# EAGLE design stm32f410rb_pcm5100 (EAGLE 7.2.0)
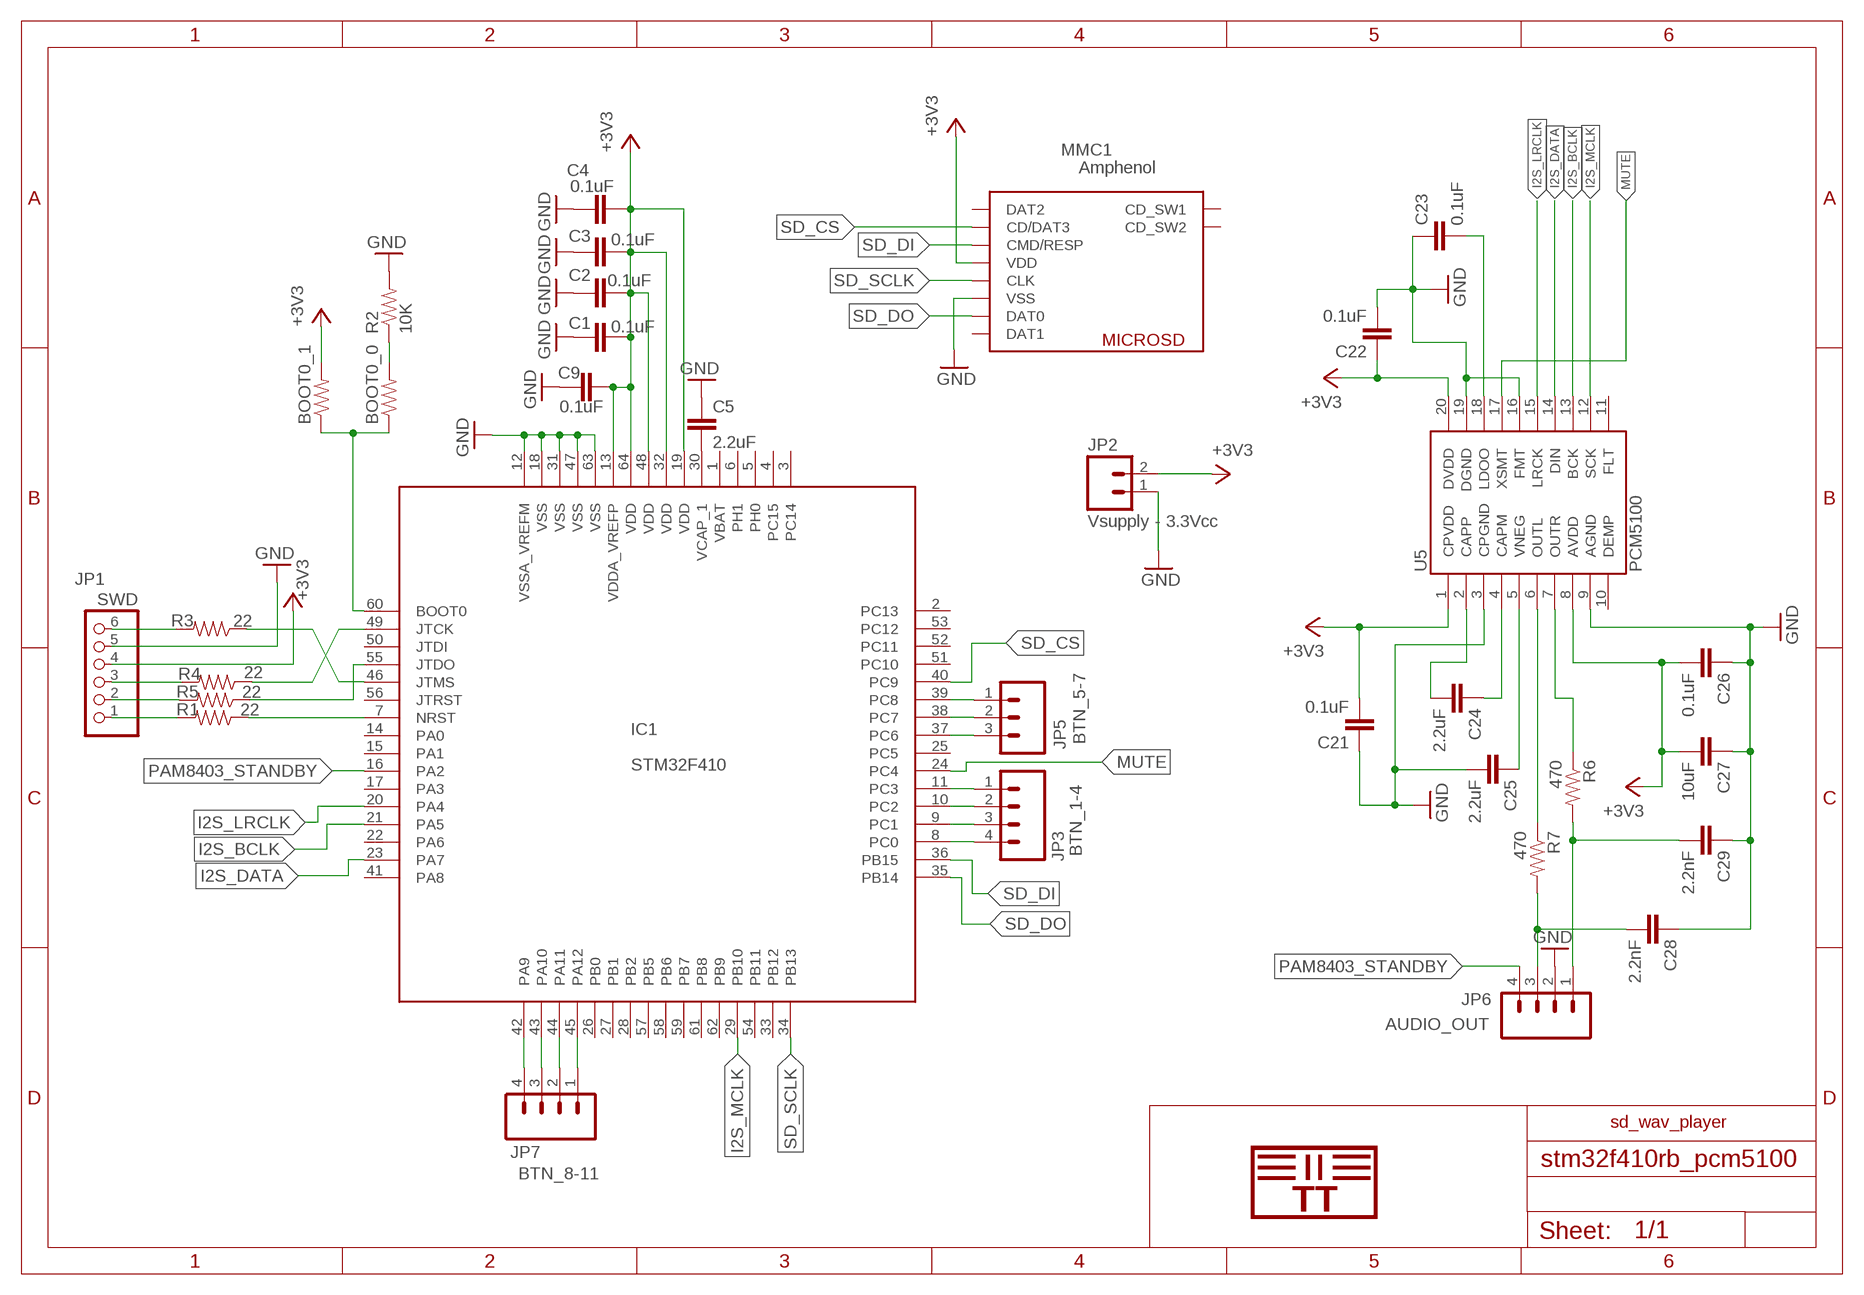
[diagram p0: schematic, sheet 1]

## Parts
BOOT0_0  RESISTOR0603-RES  [0603-RES]
BOOT0_1  RESISTOR0603-RES  [0603-RES]
C1  0.1uF  CAP0805  [0805]
C2  0.1uF  CAP0805  [0805]
C3  0.1uF  CAP0805  [0805]
C4  0.1uF  CAP0805  [0805]
C5  2.2uF  CAP0805  [0805]
C9  0.1uF  CAP0805  [0805]
C21  0.1uF  CAP0805  [0805]
C22  0.1uF  CAP0805  [0805]
C23  0.1uF  CAP0805  [0805]
C24  2.2uF  CAP0805  [0805]
C25  2.2uF  CAP0805  [0805]
C26  0.1uF  CAP0805  [0805]
C27  10uF  CAP0805  [0805]
C28  2.2nF  CAP0805  [0805]
C29  2.2nF  CAP0805  [0805]
IC1  STM32F410  STM32F410_8_B_LQFP64  [LQFP64]
JP1  SWD  PINHD-1X6  [1X06]
JP2  Vsupply - 3.3Vcc  M023.5MM  [SCREWTERMINAL-3.5MM-2]
JP3  BTN_1-4  M04SCREW  [SCREWTERMINAL-3.5MM-4]
JP5  BTN_5-7  M03SCREW  [SCREWTERMINAL-3.5MM-3]
JP6  AUDIO_OUT  M04SCREW  [SCREWTERMINAL-3.5MM-4]
JP7  BTN_8-11  M04SCREW  [SCREWTERMINAL-3.5MM-4]
MMC1  Amphenol  MICROSD_AMPHENOL  [MICROSD_AMPHENOL]
R1  22  RESISTOR0805-RES  [0805]
R2  10K  RESISTOR0805-RES  [0805]
R3  22  RESISTOR0805-RES  [0805]
R4  22  RESISTOR0805-RES  [0805]
R5  22  RESISTOR0805-RES  [0805]
R6  470  RESISTOR0805-RES  [0805]
R7  470  RESISTOR0805-RES  [0805]
U5  PCM5100  ROBERTSONICS_PCM5100  [ROBERTSONICS_PW_R-PDSO-G20]

## Nets
GND: C1.2 C2.2 C3.2 C4.2 C5.1 C9.2 C21.1 C22.2 C23.1 C25.2 C26.1 C27.1 C28.1 C29.1 IC1.12(VSSA_VREFM) IC1.18(VSS) IC1.31(VSS) IC1.47(VSS) IC1.63(VSS) JP1.5 JP2.1 JP6.2 MMC1.VSS R2.2 U5.3(CPGND) U5.9(AGND) U5.16(FMT) U5.19(DGND)
I2S_BCLK: IC1.21(PA5) U5.13(BCK)
I2S_DATA: IC1.23(PA7) U5.14(DIN)
I2S_LRCLK: IC1.20(PA4) U5.15(LRCK)
I2S_MCLK: IC1.29(PB10) U5.12(SCK)
LOUTL: C28.2 JP6.3 R7.2
LOUTR: C29.2 JP6.1 R6.2
MUTE: IC1.24(PC4) U5.17(XSMT)
N$1: IC1.11(PC3) JP3.1
N$2: IC1.10(PC2) JP3.2
N$3: IC1.9(PC1) JP3.3
N$4: IC1.8(PC0) JP3.4
N$5: C5.2 IC1.30(VCAP_1)
N$6: IC1.7(NRST) R1.1
N$7: IC1.49(JTCK) R4.1
N$8: IC1.55(JTDO) R5.1
N$9: IC1.46(JTMS) R3.1
N$10: BOOT0_0.2 R2.1
N$12: IC1.39(PC8) JP5.1
N$13: IC1.38(PC7) JP5.2
N$14: C23.2 U5.18(LDOO)
N$15: R6.1 U5.7(OUTR)
N$16: C24.2 U5.2(CAPP)
N$17: C24.1 U5.4(CAPM)
N$18: C25.1 U5.5(VNEG)
N$19: R7.1 U5.6(OUTL)
N$20: BOOT0_0.1 BOOT0_1.1 IC1.60(BOOT0)
N$21: IC1.37(PC6) JP5.3
N$22: IC1.45(PA12) JP7.1
N$23: IC1.44(PA11) JP7.2
N$24: IC1.43(PA10) JP7.3
N$25: IC1.42(PA9) JP7.4
N$26: JP1.6 R3.2
N$27: JP1.3 R4.2
N$28: JP1.2 R5.2
N$29: JP1.1 R1.2
PAM8403_STANDBY: IC1.16(PA2) JP6.4
SD_CS: IC1.40(PC9) MMC1.CD/DAT3
SD_DI: IC1.36(PB15) MMC1.CMD/RESP
SD_DO: IC1.35(PB14) MMC1.DAT0
SD_SCLK: IC1.34(PB13) MMC1.CLK
VCC: BOOT0_1.2 C1.1 C2.1 C3.1 C4.1 C9.1 C21.2 C22.1 C26.2 C27.2 IC1.13(VDDA_VREFP) IC1.19(VDD) IC1.32(VDD) IC1.48(VDD) IC1.64(VDD) JP1.4 JP2.2 MMC1.VDD U5.1(CPVDD) U5.8(AVDD) U5.20(DVDD) ; supply symbol labelled +3V3
Unconnected: IC1.1(VBAT) IC1.2(PC13) IC1.3(PC14) IC1.4(PC15) IC1.5(PH0) IC1.6(PH1) IC1.14(PA0) IC1.15(PA1) IC1.17(PA3) IC1.22(PA6) IC1.25(PC5) IC1.26(PB0) IC1.27(PB1) IC1.28(PB2) IC1.33(PB12) IC1.41(PA8) IC1.50(JTDI) IC1.51(PC10) IC1.52(PC11) IC1.53(PC12) IC1.54(PB11) IC1.56(JTRST) IC1.57(PB5) IC1.58(PB6) IC1.59(PB7) IC1.61(PB8) IC1.62(PB9) MMC1.CD_SW1 MMC1.CD_SW2 MMC1.DAT1 MMC1.DAT2 U5.10(DEMP) U5.11(FLT)

## Notes on the sheet
- sd_wav_player
- TT

## Library data of the parts
BOOT0_0 BOOT0_1 R1-R7 = SparkFun-Passives:RESISTOR: Resistor Basic schematic elements and footprints for 0603, 1206, and PTH resistors.
C1-C5 C9 C21-C29 = SparkFun-Passives:CAP: Capacitor Standard 0603 ceramic capacitor, and 0.1" leaded capacitor.
IC1 = pel_stm32:STM32F410_8_B_LQFP64: STM32F410_8_B_LQFP64.bsd edit this description Auto generated by make-symbol-device-package-bsdl.ulp Rev. 18 Source: STM32F410_8_B_LQFP64.bsd
JP1 = pinhead:PINHD-1X6: PIN HEADER
JP2 = SparkFun-Connectors:M02: Standard 2-pin 0.1" header. Use with - straight break away headers ( PRT-00116) - right angle break away headers (PRT-00553) - swiss pins (PRT-00743) - machine pins (PRT-00117) - female headers (PRT-00115) Molex polarized connector foot print use with: PRT-08233 with associated crimp pins and housings. 2.54_SCREWTERM for use with PRT-10571. 3.5mm Screw Terminal footprints for PRT-08084 5mm Screw Terminal footprints for use with PRT-08432; PROD_ID: CONN-08399
JP3 JP6 JP7 = SparkFun-Connectors:M04: Header 4 Standard 4-pin 0.1" header. Use with straight break away headers (SKU : PRT-00116), right angle break away headers (PRT-00553), swiss pins (PRT-00743), machine pins (PRT-00117), and female headers (PRT-00115). Molex polarized connector foot print use with SKU : PRT-08231 with associated crimp pins and housings. 1MM SMD Version SKU: PRT-10208
JP5 = SparkFun-Connectors:M03: Header 3 Standard 3-pin 0.1" header. Use with straight break away headers (SKU : PRT-00116), right angle break away headers (PRT-00553), swiss pins (PRT-00743), machine pins (PRT-00117), and female headers (PRT-00115). Molex polarized connector foot print use with SKU : PRT-08232 with associated crimp pins and housings.
MMC1 = microsd_amphenol:MICROSD_AMPHENOL: AMPHENOL COMMERCIAL PRODUCTS The 114-00841-68 is a top mount microSD Memory Card Connector with gold-plated contact and tin-plated solder tail. http://ro.farnell.com/amphenol-commercial-products/114-00841-68/memory-card-connector-microsd/dp/2293708?CMP=i-ddd7-00001003
U5 = stm32f410rb_pcm5100:ROBERTSONICS_PCM5100: PCM5100 Stereo DAC

## Board
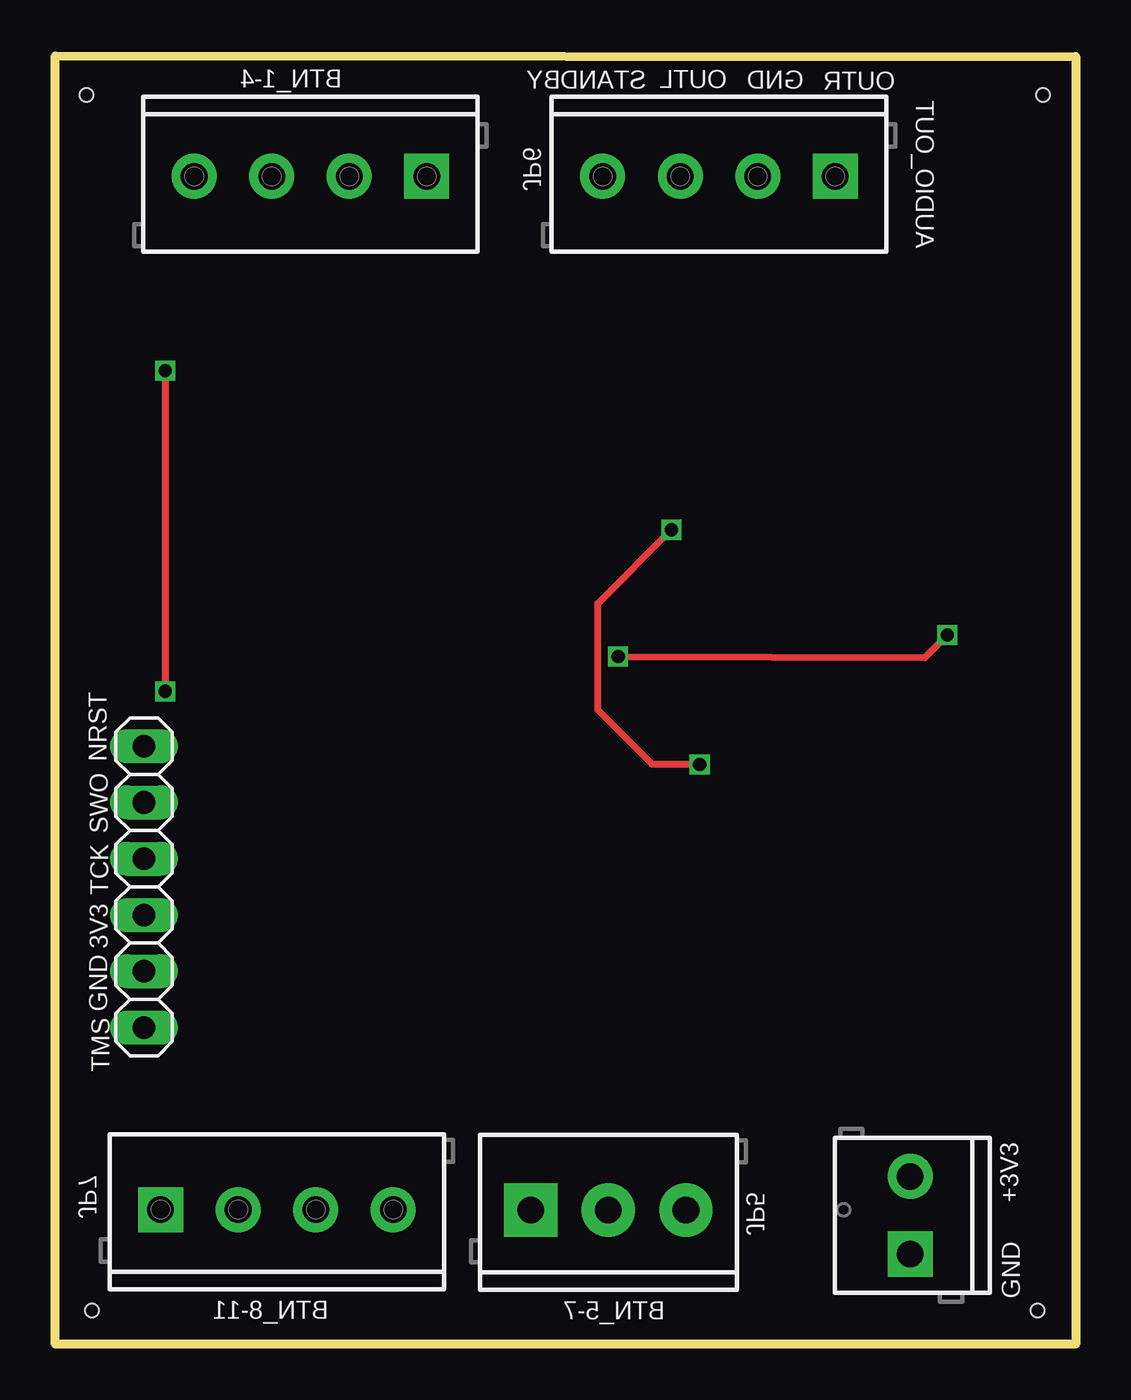
[diagram p1: board, top side]
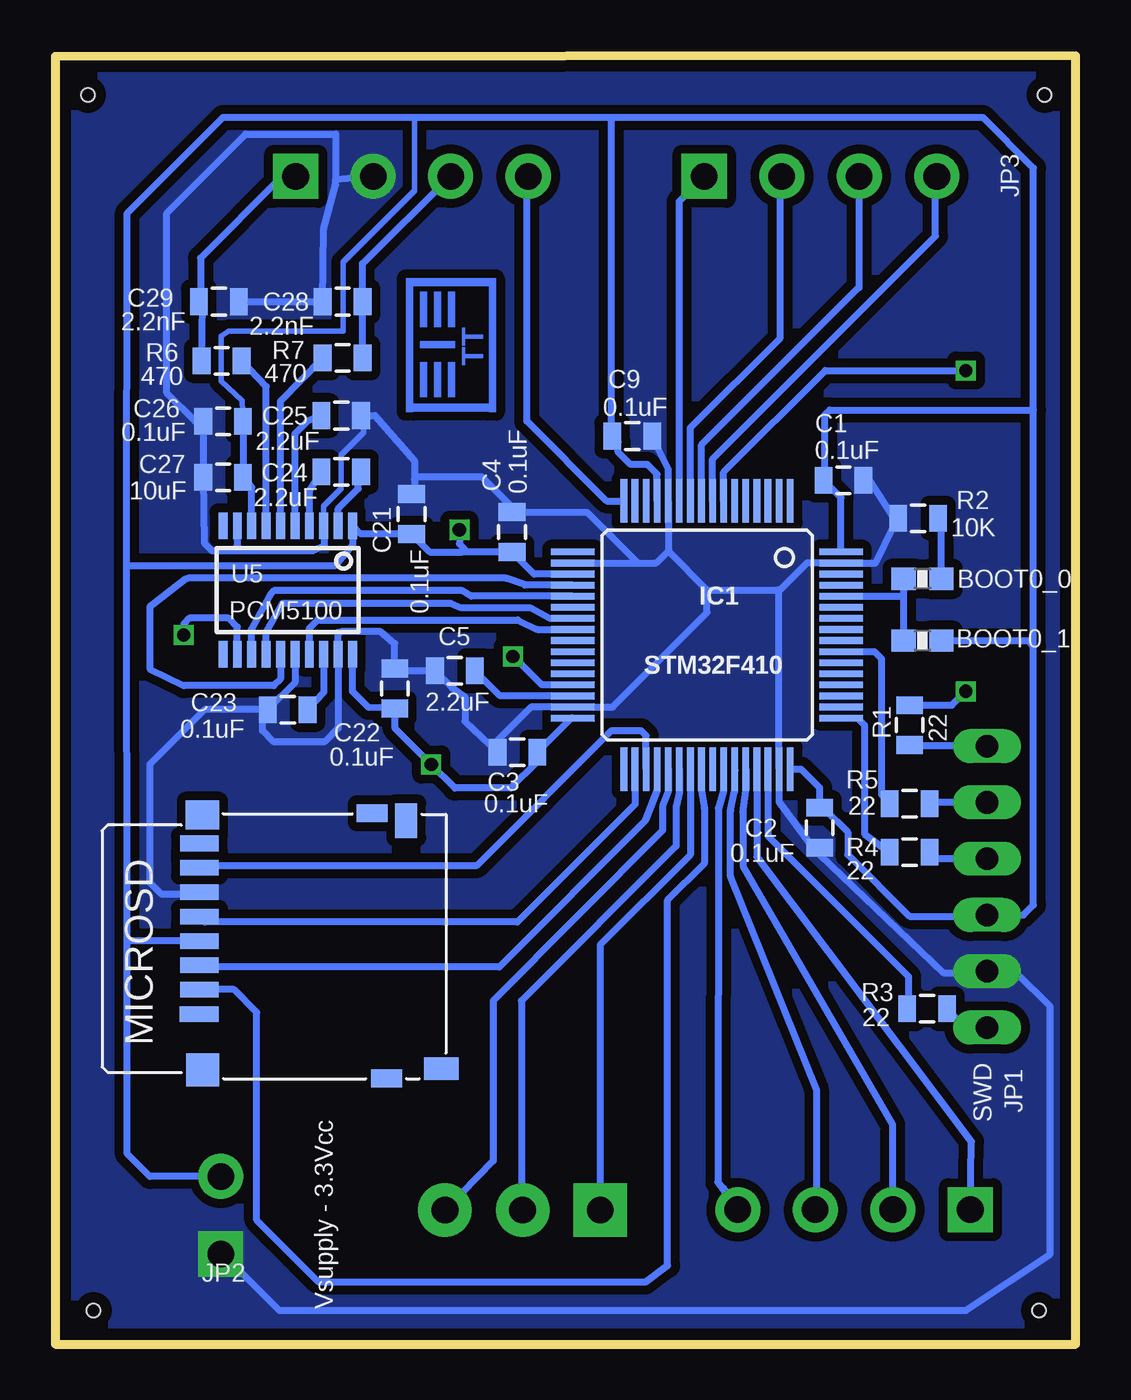
[diagram p2: board, bottom side, seen from below]

Size 46.05 x 58.17 mm. Coordinates in mm from the lower left corner, seen from the top.
Outline: 0,0 46.02,0 46.02,58.17 0,58.17 0,58.14
Outline: 0,58.14 46.05,58.12 46.05,0 0,0
Outline: 0,0 0,58.14
Copper layers (1*16): Top 0.035mm / dielectric 1.6mm / Bottom 0.035mm
Design rules "Elecrow_2-layer_PCB_eagle_rule *": minimum track width 6mil, minimum drill 12mil, track to track 6mil, track to pad 6mil, pad to pad 6mil, via to via 8mil, smd to smd 0mil, copper to edge 20mil, drill to drill 10mil, minimum pad ring 6mil, minimum via ring 6mil, stop-mask expansion 0mil, vias tented up to drill 100mil, thermal gap 10mil
Holes 0.6 mm at 1.4,56.39 44.58,56.39 1.65,1.52 44.32,1.52

### Footprints (pad centres in the part's own frame; a part is rotated, then mirrored left to right if it is on the bottom)
0603-RES = smd 1.1 x 1: 1 -0.85,0; 2 0.85,0
0805 = smd 0.8 x 1.2: 1 -0.9,0; 2 0.9,0
LQFP64 = smd 1.962 x 0.3: 1 -6.05,3.75; 2 -6.05,3.25; 3 -6.05,2.75; 4 -6.05,2.25; 5 -6.05,1.75; 6 -6.05,1.25; 7 -6.05,0.75; 8 -6.05,0.25; 9 -6.05,-0.25; 10 -6.05,-0.75; 11 -6.05,-1.25; 12 -6.05,-1.75; 13 -6.05,-2.25; 14 -6.05,-2.75; 15 -6.05,-3.25; 16 -6.05,-3.75; 33 6.05,-3.75; 34 6.05,-3.25; 35 6.05,-2.75; 36 6.05,-2.25; 37 6.05,-1.75; 38 6.05,-1.25; 39 6.05,-0.75; 40 6.05,-0.25; 41 6.05,0.25; 42 6.05,0.75; 43 6.05,1.25; 44 6.05,1.75; 45 6.05,2.25; 46 6.05,2.75; 47 6.05,3.25; 48 6.05,3.75 | smd 0.3 x 1.962: 17 -3.75,-6.05; 18 -3.25,-6.05; 19 -2.75,-6.05; 20 -2.25,-6.05; 21 -1.75,-6.05; 22 -1.25,-6.05; 23 -0.75,-6.05; 24 -0.25,-6.05; 25 0.25,-6.05; 26 0.75,-6.05; 27 1.25,-6.05; 28 1.75,-6.05; 29 2.25,-6.05; 30 2.75,-6.05; 31 3.25,-6.05; 32 3.75,-6.05; 49 3.75,6.05; 50 3.25,6.05; 51 2.75,6.05; 52 2.25,6.05; 53 1.75,6.05; 54 1.25,6.05; 55 0.75,6.05; 56 0.25,6.05; 57 -0.25,6.05; 58 -0.75,6.05; 59 -1.25,6.05; 60 -1.75,6.05; 61 -2.25,6.05; 62 -2.75,6.05; 63 -3.25,6.05; 64 -3.75,6.05
1X06 = drill 1.016 long: 1 -6.35,0; 2 -3.81,0; 3 -1.27,0; 4 1.27,0; 5 3.81,0; 6 6.35,0
SCREWTERMINAL-3.5MM-2 = drill 1.2 pad 2.032 square: 1 -1.778,0 | drill 1.2 pad 2.032: 2 1.722,0
SCREWTERMINAL-3.5MM-4 = drill 1.2 pad 2.032 square: 1 -5.334,0 | drill 1.2 pad 2.032: 2 -1.834,0; 3 1.666,0; 4 5.166,0
SCREWTERMINAL-3.5MM-3 = drill 1.2 pad 2.413 square: 1 -3.556,0 | drill 1.2 pad 2.413: 2 -0.056,0; 3 3.444,0
MICROSD_AMPHENOL = smd 0.7 x 1.75: CD/DAT3 2.1,-5.51; CLK -1.2,-5.51; CMD/RESP 1,-5.51; DAT0 -3.4,-5.51; DAT1 -4.5,-5.51; DAT2 3.21,-5.52; VDD -0.1,-5.51; VSS -2.3,-5.51 | smd 1 x 1.55: CD_SW1 5.66,5.41 | smd 1.55 x 1: CD_SW2 -5.53,3.82 | smd 1.3 x 1.5: NC1 -5.78,-5.38 | smd 1.5 x 1.5: NC2 5.72,-5.37 | smd 0.8 x 1.4: NC3 -5.86,2.29; NC_4 6.1,2.93
ROBERTSONICS_PW_R-PDSO-G20 = smd 0.4 x 1.2: 1 -2.925,-2.9; 2 -2.275,-2.9; 3 -1.625,-2.9; 4 -0.975,-2.9; 5 -0.325,-2.9; 6 0.325,-2.9; 7 0.975,-2.9; 8 1.625,-2.9; 9 2.275,-2.9; 10 2.925,-2.9; 11 2.925,2.9; 12 2.275,2.9; 13 1.625,2.9; 14 0.975,2.9; 15 0.325,2.9; 16 -0.325,2.9; 17 -0.975,2.9; 18 -1.625,2.9; 19 -2.275,2.9; 20 -2.925,2.9

### Placement (x,y rotation side)
BOOT0_0  6.91,34.54 0 bottom
BOOT0_1  6.91,31.75 0 bottom
C1  10.48,38.99 0 bottom
C2  11.56,23.3 270 bottom
C3  25.2,26.72 180 bottom
C4  25.44,36.65 90 bottom
C5  28.02,30.39 0 bottom
C9  20.02,40.98 0 bottom
C21  29.97,37.47 270 bottom
C22  30.73,29.59 90 bottom
C23  35.56,28.64 0 bottom
C24  33.15,39.37 0 bottom
C25  33.15,41.91 0 bottom
C26  38.48,41.66 0 bottom
C27  38.48,39.12 0 bottom
C28  33.08,47.05 0 bottom
C29  38.67,47.05 180 bottom
IC1  16.64,32 270 bottom
JP1  4,20.64 270 top
JP2  38.58,5.84 90 top
JP3  11.43,52.7 180 top
JP5  25.02,6.05 0 top
JP6  29.87,52.7 180 top
JP7  10.08,6.07 0 top
MMC1  34.04,18.1 270 bottom
R1  7.49,27.94 270 bottom
R2  7.11,37.27 180 bottom
R3  6.71,15.14 0 bottom
R4  7.49,22.2 0 bottom
R5  7.49,24.38 0 bottom
R6  38.54,44.39 180 bottom
R7  33.08,44.51 0 bottom
U5  35.56,34.04 180 bottom

### Tracks (layer width: path | path; a pad name or v marks a point on that pad's centre or on a via)
GND
  Bottom 0.254: U5.3 33.93,37.82 33.15,38.61 33.15,40.13 32.13,41.15 32.13,41.49 C25.2
  Bottom 0.305: 13.39,33.98 IC1.47 13.39,25.55 13.39,24.46 11.86,22.4 C2.2 11.56,22.1 5.97,16.76 4.06,16.76 JP1.5 3.94,16.76 2.67,16.76 1.14,15.24 1.14,4.06 4.95,1.52 35.94,1.52 38.48,4.06 JP2.1 | 18.39,35.79 IC1.12 18.39,39.49 C9.2 | 18.39,35.79 16.64,34.04 | 16.64,34.04 13.44,34.04 13.39,33.98 | IC1.18 19.76,35.25 | 19.76,35.25 18.92,35.25 18.39,35.79 | 8,37.31 R2.2 | 8.23,37.31 8.23,36.88 9.02,35.25 IC1.63 12.12,35.25 13.39,33.98 | 8.23,37.31 8.05,37.27 R2.2 | C29.1 C28.1 33.93,50.32 33.4,52.32 33.4,52.58 | C25.2 31.62,41.91 29.85,39.88 29.85,39.04 | 29.85,39.04 29.85,38.44 C21.1 | U5.9 37.84,35.93 37.72,35.81 | 37.72,35.81 34.42,35.81 33.91,36.07 33.91,36.91 U5.3 | 37.72,35.81 38.99,35.81 39.33,36.16 C27.1 C26.1 39.75,41.66 41.02,42.93 41.02,51.05 37.46,54.61 33.4,54.61 33.4,52.58 | 33.4,52.58 JP6.2 | C23.1 39.31,28.64 41.78,26.16 41.78,20.83 41.27,20.32 39.62,20.32 MMC1.VSS | C22.2 30.73,31.62 31.37,32.16 33.15,32.16 33.28,32.12 U5.19 33.28,27.8 33.91,27.18 36.2,27.18 36.7,27.69 36.7,28.35 C23.1 | 36.45,28.68 C23.1 | 30.71,30.42 C22.2 | 16.64,34.04 16.64,33.02 20.9,28.75 IC1.31 24.59,28.75 26.09,27.25 26.09,26.73 C3.2 27.56,28.11 27.56,29.21 28.16,29.63 C5.1 30.63,30.39 C22.2 | C1.2 9.63,38.94 9.27,38.94 8.23,37.31 | 8.23,37.31 R2.2 | 29.85,39.04 29.74,39.14 26.8,39.14 25.44,37.78 C4.2 22.06,37.55 19.76,35.25 | U5.16 35.23,29.86 C23.1
  pour Bottom (isolate 0.406, no thermals): -0.03,58.19 46.05,58.19 46.05,-0.08 -0.03,-0.08
I2S_BCLK
  Bottom 0.305: U5.13 37.21,31.16 37.21,32.26 36.37,33.78 36.19,34.01 27.69,34.01 27.28,33.75 IC1.21
I2S_DATA
  Bottom 0.305: U5.14 36.53,32.17 35.81,33.43 28.19,33.43 27.71,33.22 24.61,33.22 23.74,32.75 IC1.23
I2S_LRCLK
  Bottom 0.305: IC1.20 24.86,34.25 24.88,34.28 25.73,34.57 40.07,34.57 40.17,34.53 41.78,33.27 41.78,30.48 40.26,29.72 36.2,29.72 35.88,30.03 U5.15
I2S_MCLK  (via drill 0.6)
  Top 0.305: v25.4,31.04 39.24,30.99 v40.26,32
  Bottom 0.305: IC1.29 24.09,29.75 25.02,30.68 v25.4,31.04 | U5.12 37.84,32.37 38.23,32.77 40,32.77 40.26,32.51 v40.26,32
LOUTL
  Bottom 0.305: R7.2 C28.2 32.18,48.78 JP6.3
LOUTR
  Bottom 0.305: R6.2 39.39,46.93 C29.2 39.5,47.08 39.5,49.02 35.94,52.58 JP6.1
MUTE
  Bottom 0.305: IC1.24 22.39,32.26 24.31,32.26 25.15,32.66 25.17,32.69 34.21,32.69 34.59,32.32 U5.17
N$1
  Bottom 0.305: IC1.11 17.89,51.58 JP3.1
N$2
  Bottom 0.305: JP3.2 13.33,52.52 13.33,45.41 17.39,41.36 IC1.10
N$3
  Bottom 0.305: IC1.9 16.89,40.59 9.8,47.68 9.76,47.68 JP3.3 9.78,52.47
N$4
  Bottom 0.305: IC1.8 16.39,39.95 6.33,50.01 6.33,52.51 JP3.4
N$5
  Bottom 0.305: IC1.30 25.98,29.25 C5.2
N$6  (via drill 0.6)
  Top 0.305: v4.95,43.94 v4.95,29.46
  Bottom 0.305: IC1.7 15.89,39.36 11.3,43.94 v4.95,43.94 | R1.1 5.58,28.84 v4.95,29.46
N$7
  Bottom 0.305: IC1.49 9.84,28.25 9.52,27.94 9.52,23.03 R4.1
N$8
  Bottom 0.305: IC1.55 9.08,31.25 8.76,30.94 8.76,24.8 R5.1
N$9
  Bottom 0.305: IC1.46 13.89,22.93 7.54,16.59 7.54,15.2 R3.1
N$10
  Bottom 0.305: BOOT0_0.2 6.06,37.12 R2.1
N$12
  Bottom 0.305: JP5.1 21.46,18.01 17.39,22.09 IC1.39
N$13
  Bottom 0.305: JP5.2 25.02,6.15 25.02,15.49 18.03,22.48 18.03,24.23 17.89,24.91 IC1.38
N$14
  Bottom 0.305: U5.18 33.93,29.41 C23.2
N$15
  Bottom 0.305: U5.7 36.53,43.23 R6.1
N$16
  Bottom 0.305: U5.2 33.28,37.71 32.38,38.61 32.38,39.03 C24.2
N$17
  Bottom 0.305: U5.4 34.59,38.53 C24.1
N$18
  Bottom 0.305: U5.5 35.23,41.09 34.67,41.66 C25.1
N$19
  Bottom 0.305: U5.6 35.88,42.56 R7.1
N$20
  Bottom 0.305: IC1.60 7.78,33.75 7.76,33.73 | BOOT0_1.1 7.76,33.73 | 7.76,33.73 BOOT0_0.1
N$21
  Bottom 0.305: JP5.3 26.29,8.27 26.29,15.49 18.64,23.19 18.64,24.26 18.39,24.95 IC1.37
N$22
  Bottom 0.305: JP7.1 4.7,9.14 14.39,22.01 IC1.45
N$23
  Bottom 0.305: IC1.44 14.88,24.99 15.01,23.98 15.01,21.59 8.25,9.91 JP7.2
N$24
  Bottom 0.305: JP7.3 11.7,6.86 | 11.7,6.86 11.7,7 | IC1.43 15.39,25.8 15.39,24.94 15.57,24.05 15.57,21.11 11.71,11.51 11.71,6.86 11.7,6.86
N$25
  Bottom 0.305: 15.89,7.04 JP7.4 16.15,7.3 16.13,24.18 15.89,24.95 IC1.42
N$26
  Bottom 0.305: JP1.6 4.1,14.39 5.06,14.39 R3.2
N$27
  Bottom 0.305: JP1.3 6.58,21.91 R4.2
N$28
  Bottom 0.305: JP1.2 6.58,24.45 R5.2
N$29
  Bottom 0.305: JP1.1 7.39,26.99 R1.2
PAM8403_STANDBY
  Bottom 0.305: JP6.4 24.77,52.49 24.77,41.66 21.17,38.06 IC1.16
SD_CS
  Bottom 0.305: MMC1.CD/DAT3 37.99,16 36.96,14.97 36.96,5.59 34.16,2.79 19.43,2.79 18.42,3.56 18.42,20.04 16.76,21.69 16.76,24.18 16.89,24.96 IC1.40
SD_DI
  Bottom 0.305: MMC1.CMD/RESP 39.47,17.02 26.01,17.02 19.41,23.64 19.41,23.66 19.18,24.28 18.89,24.98 IC1.36
SD_DO
  Bottom 0.305: MMC1.DAT0 39.45,21.59 27.05,21.59 20.96,27.69 19.61,27.69 19.39,27.46 IC1.35
SD_SCLK
  Bottom 0.305: IC1.34 19.89,24.36 25.2,19.05 39.3,19.05 MMC1.CLK
VCC  (via drill 0.6)
  Top 0.305: v29.08,26.16 26.92,26.16 26.92,26.19 24.49,28.63 24.49,33.43 v27.81,36.75
  Bottom 0.254: C26.2 37.63,42.58 38.56,43.46 38.56,45.49 38.23,45.72 33.07,45.72 33.07,48.84 29.85,52.07 29.85,55.37
  Bottom 0.305: U5.8 37.18,38.67 C27.2 C26.2 | v29.08,26.16 30.73,27.81 C22.1 31.92,28.74 32.64,29.46 U5.20 | 28.83,25.91 v29.08,26.16 | 42.8,18.29 42.8,8.58 41.78,7.56 JP2.2 | 42.8,18.29 42.82,35.13 | 42.82,35.13 42.8,51.05 38.48,55.37 29.85,55.37 20.96,55.37 | 42.82,35.13 33.43,35.13 32.63,36.07 U5.1 32.26,36.56 C21.2 29.16,35.75 27.67,35.75 | 1.91,31.5 1.91,19.81 2.35,19.37 JP1.4 4.06,19.3 7.49,19.3 10.29,22.1 10.29,23.11 11.33,24.15 C2.1 11.56,25.12 12.39,25.95 IC1.48 | 1.91,31.5 1.91,42.16 | 1.91,42.16 1.91,53.09 4.19,55.37 20.96,55.37 | BOOT0_1.2 2.16,31.75 1.91,31.5 | 1.91,42.16 11.1,42.16 11.33,41.94 11.33,39.04 C1.1 10.59,38.2 IC1.64 | 20.96,55.37 20.96,40.62 C9.1 20.65,40.72 20.65,40.26 20.09,39.7 19.33,39.7 18.89,39.26 IC1.13 | MMC1.VDD 42.71,18.2 42.8,18.29 | IC1.19 24.44,34.75 C4.1 27.67,35.75 | IC1.32 22.76,28.25 C3.1 24.3,26.3 25.5,25.09 28.02,25.09 v29.08,26.16 | 27.67,35.75 27.56,35.87 27.81,36.12 v27.81,36.75
(copper drawn outside any net)
  shapes: Bottom area x11

### Text on the board
Bottom: TT
tPlace: OUTL | STANDBY | GND | OUTR | NRST | SWO | TCK | 3V3 | GND | TMS | +3V3 | GND